# EAGLE design main (EAGLE 9.0.1)
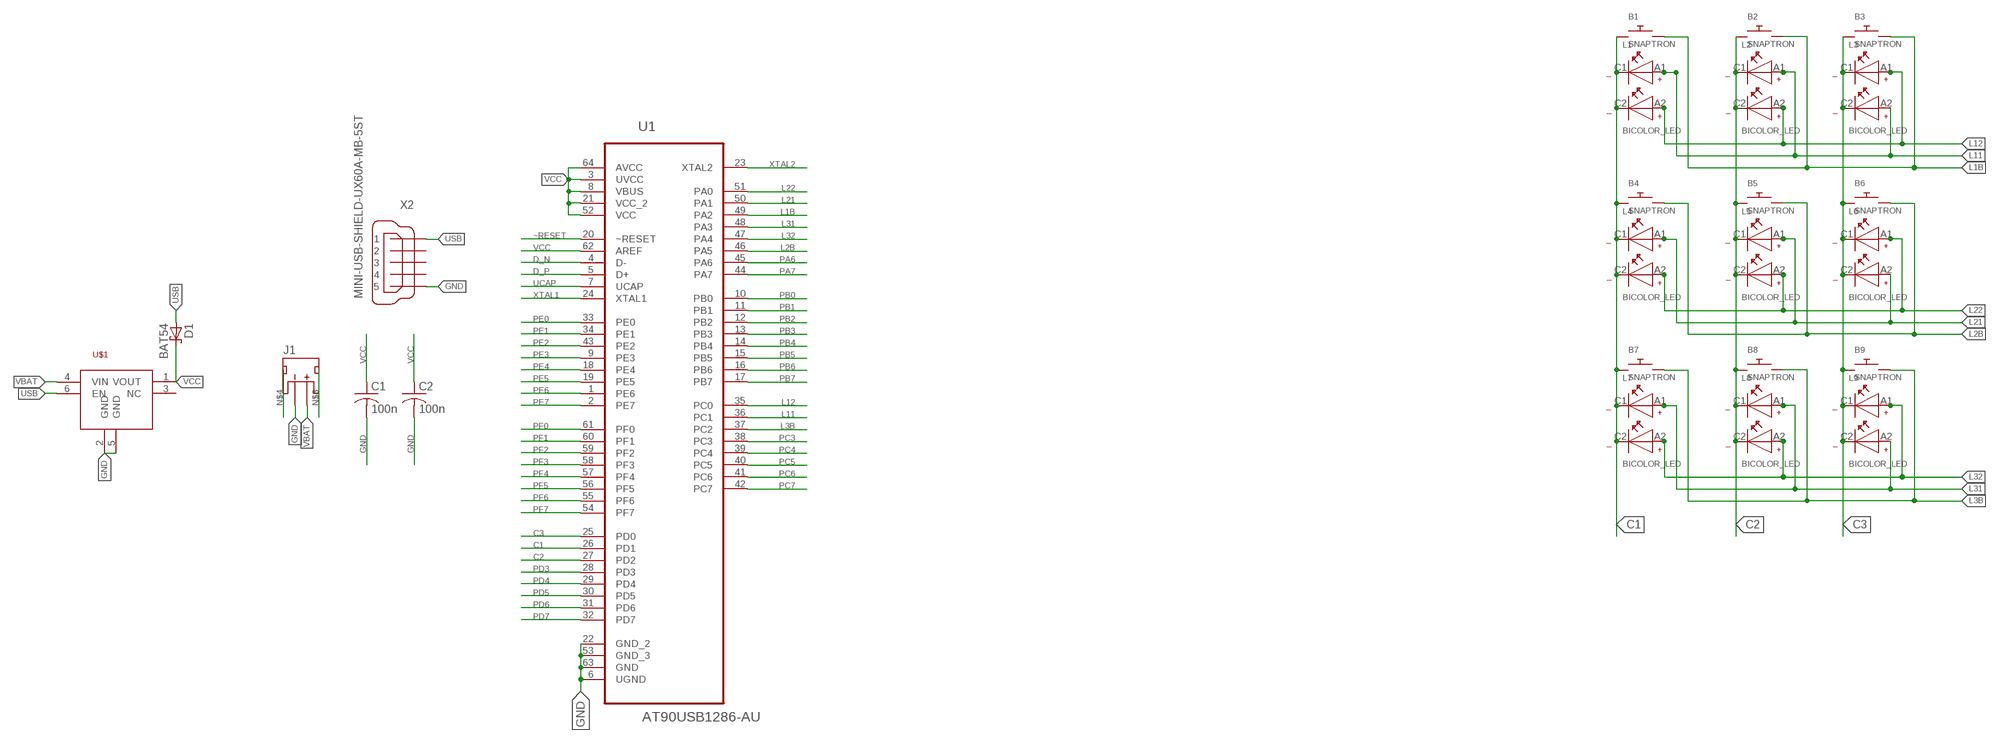
[diagram p0: schematic, sheet 1]

## Parts
B1  SNAPTRON  [SNAPTRON-8.5]
B2  SNAPTRON  [SNAPTRON-8.5]
B3  SNAPTRON  [SNAPTRON-8.5]
B4  SNAPTRON  [SNAPTRON-8.5]
B5  SNAPTRON  [SNAPTRON-8.5]
B6  SNAPTRON  [SNAPTRON-8.5]
B7  SNAPTRON  [SNAPTRON-8.5]
B8  SNAPTRON  [SNAPTRON-8.5]
B9  SNAPTRON  [SNAPTRON-8.5]
C1  100n  C-USC0603  [C0603]
C2  100n  C-USC0603  [C0603]
D1  BAT54  [SOT23]
J1  JST_2MM_MALE  [JST-2-SMD]
L1  BICOLOR_LED  [BICOLOR_LED]
L2  BICOLOR_LED  [BICOLOR_LED]
L3  BICOLOR_LED  [BICOLOR_LED]
L4  BICOLOR_LED  [BICOLOR_LED]
L5  BICOLOR_LED  [BICOLOR_LED]
L6  BICOLOR_LED  [BICOLOR_LED]
L7  BICOLOR_LED  [BICOLOR_LED]
L8  BICOLOR_LED  [BICOLOR_LED]
L9  BICOLOR_LED  [BICOLOR_LED]
U1  AT90USB1286-AU  [QFP80P1600X1600X120-64N]
U$1  MIC94090  [SC70-6L]
X2  MINI-USB-SHIELD-UX60A-MB-5ST  [UX60A-MB-5ST]

## Nets
C1: B1.P$1 B4.P$1 B7.P$1 L1.C1 L1.C2 L4.C1 L4.C2 L7.C1 L7.C2 U1.26(PD1)
C2: B2.P$1 B5.P$1 B8.P$1 L2.C1 L2.C2 L5.C1 L5.C2 L8.C1 L8.C2 U1.27(PD2)
C3: B3.P$1 B6.P$1 B9.P$1 L3.C1 L3.C2 L6.C1 L6.C2 L9.C1 L9.C2 U1.25(PD0)
D_N: U1.4(D-)
D_P: U1.5(D+)
GND: C1.2 C2.2 J1.1(-) U1.6(UGND) U1.22(GND_2) U1.53(GND_3) U1.63(GND) U$1.2(GND) U$1.5(GND) X2.5
L1B: B1.P$2 B2.P$2 B3.P$2 U1.49(PA2)
L2B: B4.P$2 B5.P$2 B6.P$2 U1.46(PA5)
L3B: B7.P$2 B8.P$2 B9.P$2 U1.37(PC2)
L11: L1.A1 L2.A1 L3.A2 U1.36(PC1)
L12: L1.A2 L2.A2 L3.A1 U1.35(PC0)
L21: L4.A1 L5.A1 L6.A2 U1.50(PA1)
L22: L4.A2 L5.A2 L6.A1 U1.51(PA0)
L31: L7.A1 L8.A1 L9.A2 U1.48(PA3)
L32: L7.A2 L8.A2 L9.A1 U1.47(PA4)
N$3: J1.NC2(PAD2)
N$4: J1.NC1(PAD1)
PA6: U1.45(PA6)
PA7: U1.44(PA7)
PB0: U1.10(PB0)
PB1: U1.11(PB1)
PB2: U1.12(PB2)
PB3: U1.13(PB3)
PB4: U1.14(PB4)
PB5: U1.15(PB5)
PB6: U1.16(PB6)
PB7: U1.17(PB7)
PC3: U1.38(PC3)
PC4: U1.39(PC4)
PC5: U1.40(PC5)
PC6: U1.41(PC6)
PC7: U1.42(PC7)
PD3: U1.28(PD3)
PD4: U1.29(PD4)
PD5: U1.30(PD5)
PD6: U1.31(PD6)
PD7: U1.32(PD7)
PE0: U1.33(PE0)
PE1: U1.34(PE1)
PE2: U1.43(PE2)
PE3: U1.9(PE3)
PE4: U1.18(PE4)
PE5: U1.19(PE5)
PE6: U1.1(PE6)
PE7: U1.2(PE7)
PF0: U1.61(PF0)
PF1: U1.60(PF1)
PF2: U1.59(PF2)
PF3: U1.58(PF3)
PF4: U1.57(PF4)
PF5: U1.56(PF5)
PF6: U1.55(PF6)
PF7: U1.54(PF7)
UCAP: U1.7(UCAP)
USB: D1.1(A) U$1.6(EN) X2.1
VBAT: J1.2(+) U$1.4(VIN)
VCC: C1.1 C2.1 D1.3(C) U1.3(UVCC) U1.8(VBUS) U1.21(VCC_2) U1.52(VCC) U1.62(AREF) U1.64(AVCC) U$1.1(VOUT)
XTAL1: U1.24(XTAL1)
XTAL2: U1.23(XTAL2)
~RESET: U1.20(~RESET)
Unconnected: U$1.3(NC) X2.2 X2.3 X2.4 X2.M1(S1) X2.M2(S2) X2.M3(S3) X2.M4(S4)

## Library data of the parts
B1-B9 = 7_segment_lib:SNAPTRON
C1 C2 = rcl:C-US: CAPACITOR, American symbol; SPICEPREFIX: C
D1 = diode:BAT54: Schottky Diodes Source: Fairchild .. BAT54.pdf
J1 = SparkFun-Connectors:JST_2MM_MALE: JST 2MM MALE RA CONNECTOR Two pin, compact surface mount connector. Commonly used as a battery input connection point. We really like the solid locking feeling and high current rating on these small connectors. We use these all the time as battery connectors. Mates to single-cell LiPo batteries. Here is the connector we sell at SparkFun: JST Right Angle Connector - White <https://www.sparkfun.com/products/8612> (PRT-08612) Datasheet <http://www.sparkfun.com/datasheets/Prototyping/Connectors/JST-Horizontal.pdf> It was used on these SparkFun products: SparkFun MOSFET Power Controller <https://www.sparkfun.com/products/11214> (PRT-11214) SparkFun Battery Babysitter - LiPo Battery Manager <https://www.sparkfun.com/products/13777> (PRT-13777) And many, many others that required a lipo battery connection.; PROD_ID: CONN-11443; SF_ID: PRT-08612
L1-L9 = 7_segment_lib:BICOLOR_LED
U1 = Atmel_By_element14_Batch_1-00:AT90USB1286-AU: MCU; DESCRIPTION: MCU; MPN: AT90USB1286-AU; OC_FARNELL: 1748495; OC_NEWARK: 26R5675; PACKAGE: QFP-64; SUPPLIER: Atmel
U$1 = 7_segment_lib:MIC94090
X2 = con-hirose:MINI-USB-SHIELD-: MINI USB Connector Source: http://www.hirose.co.jp/cataloge_hp/e24000019.pdf; OC_FARNELL: unknown; OC_NEWARK: unknown

## Board
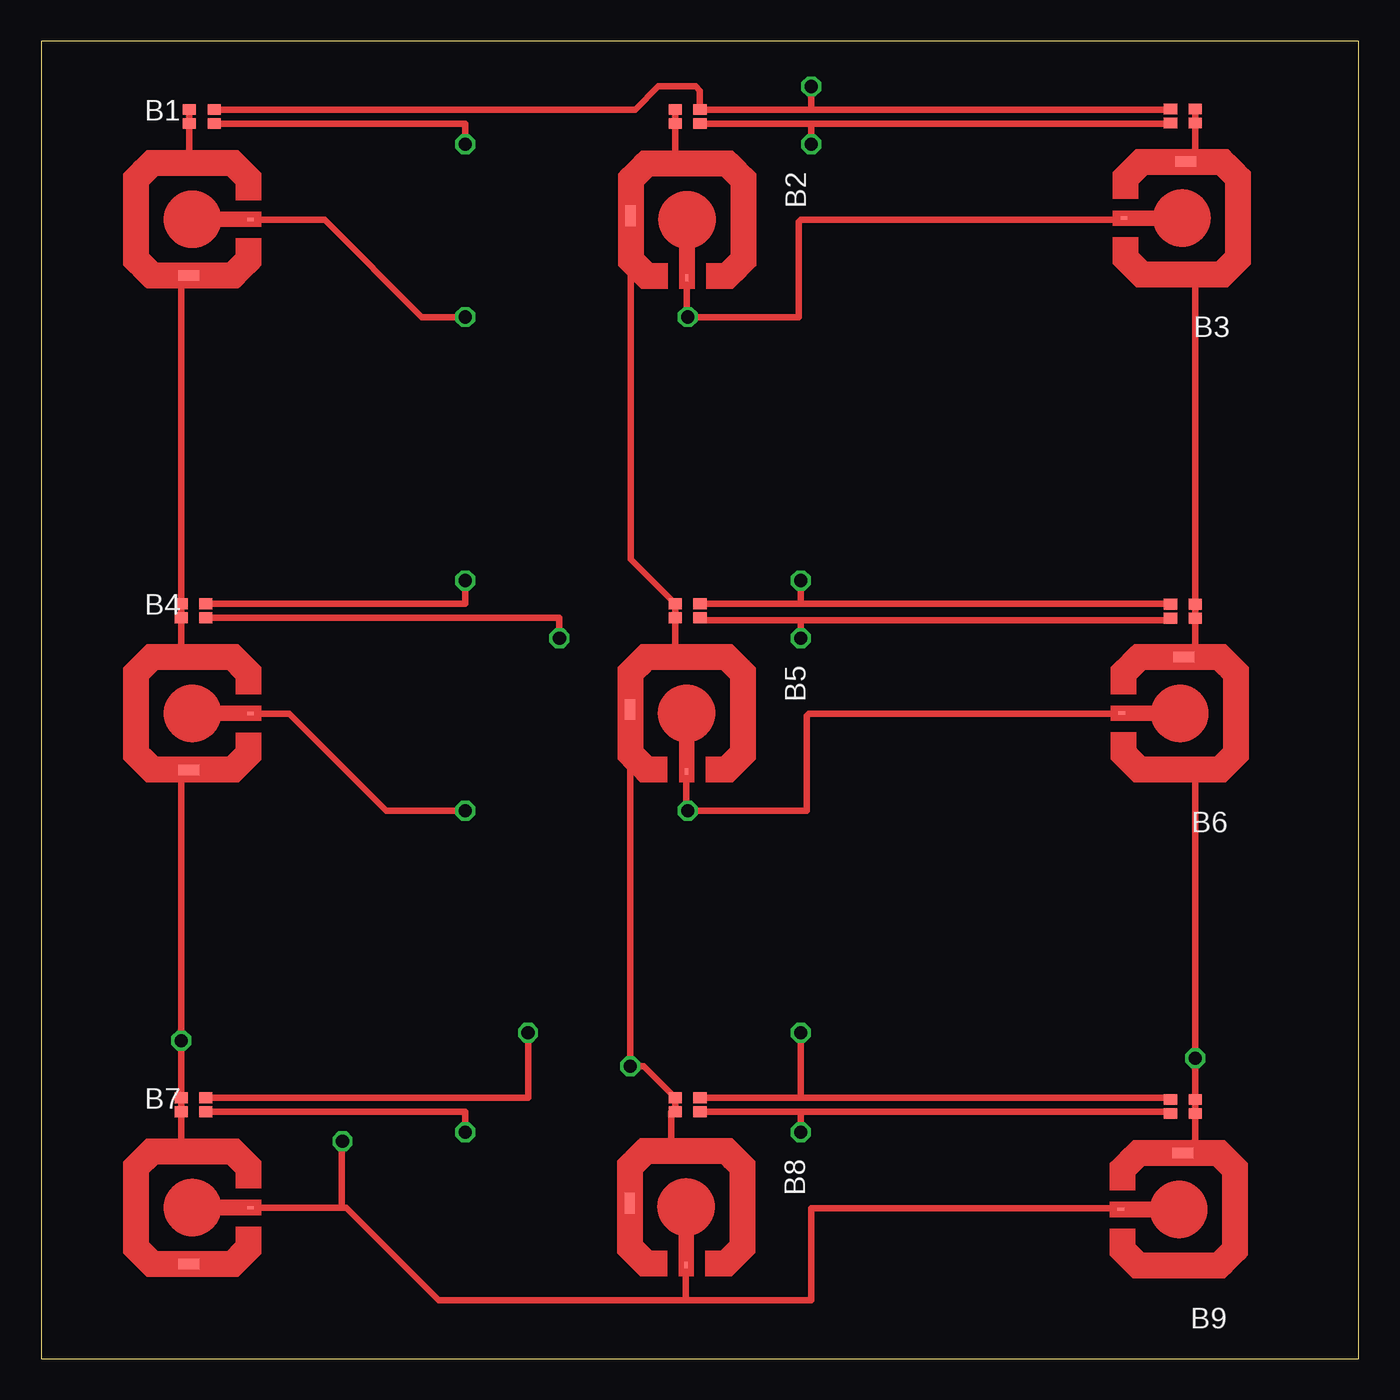
[diagram p1: board, top side]
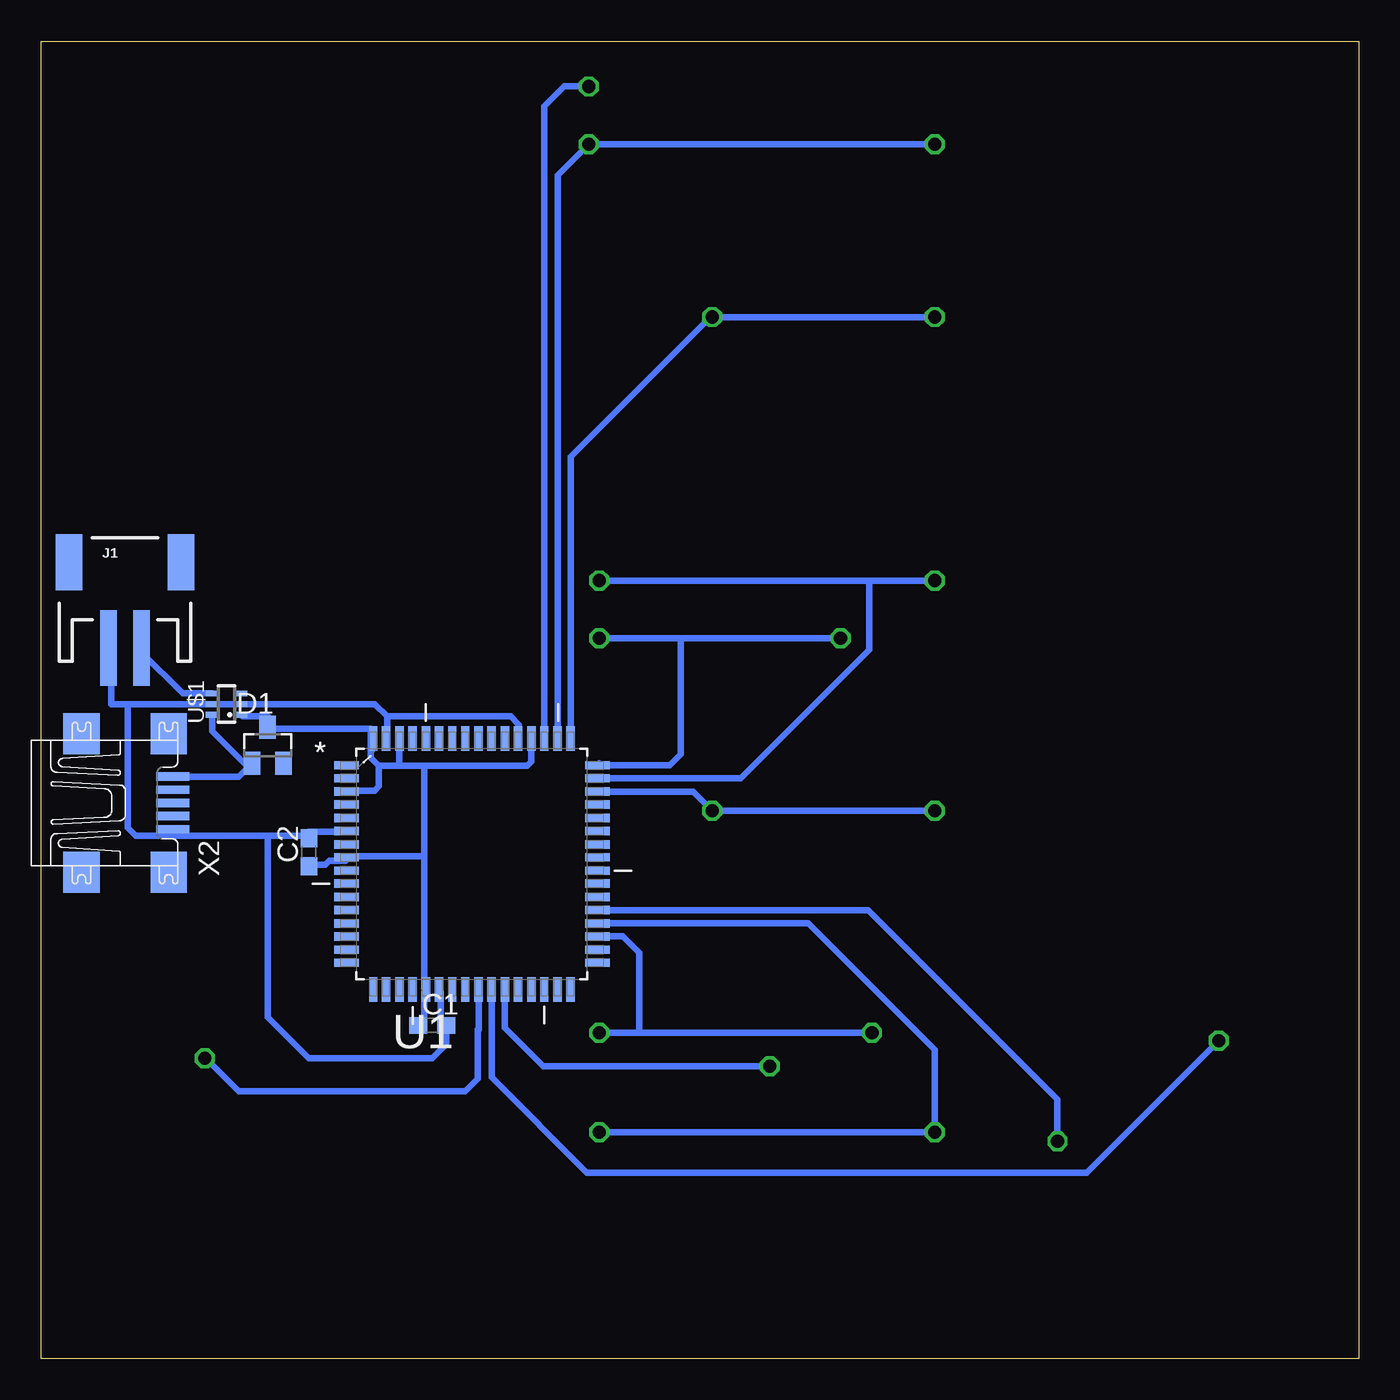
[diagram p2: board, bottom side, seen from below]

Size 80 x 80 mm. Coordinates in mm from the lower left corner, seen from the top.
Outline: 0,0 80,0 80,80 0,80 0,0
Copper layers (1*16): Top 0.035mm / dielectric 1.5mm / Bottom 0.035mm
Design rules "default *": minimum track width 16mil, minimum drill 0.35mm, track to track 6mil, track to pad 6mil, pad to pad 6mil, via to via 6mil, smd to smd 6mil, copper to edge 40mil, drill to drill 6mil, minimum pad ring 10mil, minimum via ring 8mil, stop-mask expansion 4mil, vias tented up to drill 0mil, thermal gap 10mil

### Footprints (pad centres in the part's own frame; a part is rotated, then mirrored left to right if it is on the bottom)
SNAPTRON-8.5 = smd 1.27 x 0.635: P$1 3.95,0.763 | smd 0.406 x 0.203: P$2 7.708,4.171
C0603 = smd 1.1 x 1: 1 -0.85,0; 2 0.85,0
SOT23 = smd 1 x 1.4: 1 -0.95,-1.1; 2 0.95,-1.1; 3 0,1.1
JST-2-SMD = smd 1 x 4.6: 1 -1,-3.7; 2 1,-3.7 | smd 1.6 x 3.4: NC1 -3.4,1.5; NC2 3.4,1.5
BICOLOR_LED = smd 0.8 x 0.65: A1 0,0; A2 0,-0.85; C1 1.5,0; C2 1.5,-0.85
QFP80P1600X1600X120-64N = smd 1.473 x 0.508: 1 -7.62,5.994; 2 -7.62,5.207; 3 -7.62,4.394; 4 -7.62,3.607; 5 -7.62,2.794; 6 -7.62,2.007; 7 -7.62,1.194; 8 -7.62,0.406; 9 -7.62,-0.406; 10 -7.62,-1.194; 11 -7.62,-2.007; 12 -7.62,-2.794; 13 -7.62,-3.607; 14 -7.62,-4.394; 15 -7.62,-5.207; 16 -7.62,-5.994; 33 7.62,-5.994; 34 7.62,-5.207; 35 7.62,-4.394; 36 7.62,-3.607; 37 7.62,-2.794; 38 7.62,-2.007; 39 7.62,-1.194; 40 7.62,-0.406; 41 7.62,0.406; 42 7.62,1.194; 43 7.62,2.007; 44 7.62,2.794; 45 7.62,3.607; 46 7.62,4.394; 47 7.62,5.207; 48 7.62,5.994 | smd 0.508 x 1.473: 17 -5.994,-7.62; 18 -5.207,-7.62; 19 -4.394,-7.62; 20 -3.607,-7.62; 21 -2.794,-7.62; 22 -2.007,-7.62; 23 -1.194,-7.62; 24 -0.406,-7.62; 25 0.406,-7.62; 26 1.194,-7.62; 27 2.007,-7.62; 28 2.794,-7.62; 29 3.607,-7.62; 30 4.394,-7.62; 31 5.207,-7.62; 32 5.994,-7.62; 49 5.994,7.62; 50 5.207,7.62; 51 4.394,7.62; 52 3.607,7.62; 53 2.794,7.62; 54 2.007,7.62; 55 1.194,7.62; 56 0.406,7.62; 57 -0.406,7.62; 58 -1.194,7.62; 59 -2.007,7.62; 60 -2.794,7.62; 61 -3.607,7.62; 62 -4.394,7.62; 63 -5.207,7.62; 64 -5.994,7.62
SC70-6L = smd 0.35 x 0.8: 1 -0.65,-0.85; 2 0,-0.85; 3 0.65,-0.85; 4 0.65,0.85; 5 0,0.85; 6 -0.65,0.85
UX60A-MB-5ST = smd 2 x 0.5: 1 2.25,1.6; 2 2.25,0.8; 3 2.25,0; 4 2.25,-0.8; 5 2.25,-1.6 | smd 2.2 x 2.5: M1 -3.3,-4.2; M2 -3.3,4.2; M3 2,4.2; M4 2,-4.2

### Placement (x,y rotation side)
B1  5,65 0 top
B2  35.03,73.34 270 top
B3  73.44,73.44 180 top
B4  5,35 0 top
B5  35,43.37 270 top
B6  73.32,43.37 180 top
B7  5,5 0 top
B8  34.97,13.4 270 top
B9  73.25,13.25 180 top
C1  56.25,20.25 0 bottom
C2  63.75,30.75 90 bottom
D1  66.25,37.25 0 bottom
J1  74.91,46.86 0 bottom
L1  10,15 180 top
L2  40,15 180 top
L3  68.57,15.75 0 top
L4  10.5,75 180 top
L5  40,75 180 top
L6  68.57,75.89 0 top
L7  10,45 180 top
L8  40,45 180 top
L9  68.57,45.82 0 top
U1  53.85,30.04 0 bottom
U$1  68.75,39.75 90 bottom
X2  74.25,33.75 0 bottom

### Tracks (layer width: path | path; a pad name or v marks a point on that pad's centre or on a via)
C1  (via drill 0.8)
  Top 0.406: B7.P$1 7.46,5.76 5.72,7.5 5.72,11.44 6.74,12.45 8.52,12.45 8.52,14.98 L1.C1 L1.C2 v8.5,19.32 | v8.5,19.32 8.5,30.25 v8.5,19.32 | v8.5,19.32 8.5,35.31 | 8.5,35.31 8.5,35.71 8.39,35.82 | L4.C2 L4.C1 9,72.75 8.64,72.4 6.61,72.4 5.85,71.63 5.85,66.94 7.02,65.76 B1.P$1 8.5,65.31 L7.C2 L7.C1 8.52,44.98 8.52,42.55 6.74,42.55 5.85,41.66 5.85,37.09 7.18,35.76 B4.P$1 8.5,35.31 | v8.5,19.32 8.5,35.31
  Bottom 0.406: v8.5,19.32 16.51,11.31 46.87,11.31 52.65,17.09 U1.26
C2  (via drill 0.8)
  Top 0.406: B8.P$1 35.73,11.73 36.75,12.75 38.25,12.75 38.25,15 L2.C1 L2.C2 36.59,17.77 v35.76,17.77 35.76,39.25 | 35.76,39.25 B5.P$1 | 35.76,39.25 35.76,41.76 36.75,42.75 38.25,42.75 38.5,43 L8.C1 L8.C2 35.79,48.56 35.79,69.25 | 35.79,69.25 B2.P$1 | L5.C2 L5.C1 38.5,73 38.25,72.75 37.25,72.75 35.75,71.25 35.75,69.29 35.79,69.25
  Bottom 0.406: v35.76,17.77 49.52,17.77 51.84,20.09 U1.27
C3  (via drill 0.8)
  Top 0.406: B9.P$1 70.07,13.26 L3.C2 L3.C1 v70.07,18.25 70.07,35.53 70.36,35.82 71.51,35.82 72.52,36.84 72.52,41.03 71.38,42.17 71.38,42.68 69.44,42.68 B6.P$1 70.07,43.31 L9.C2 L9.C1 70.07,65.5 70.49,65.92 71.38,65.92 72.65,67.19 72.65,71.51 71.38,72.78 69.59,72.78 B3.P$1 70.07,73.26 L6.C2 L6.C1
  Bottom 0.406: 53.44,19.98 53.44,20 | 53.44,20 U1.25 | v70.07,18.25 70,18.25 68,16.25 54.25,16.25 53.5,17 53.5,20 53.44,20
GND
  Bottom 0.406: C1.2 55.5,20.25 55.75,20.5 55.75,22.25 U1.22 | 71.75,31.75 72,31.75 72,32 X2.5 | 71.75,31.75 66.25,31.75 | 66.25,31.75 64.75,31.75 63.75,31.75 | 63.75,31.75 C2.2 63.75,31.75 | 63.75,31.75 63.75,32 61.5,32 U1.6 | 55.75,20.25 C1.2 | 59,39 51.5,39 51,38.5 51,37.75 U1.53 | 59,39 59,37.75 U1.63 | 74.75,39.75 75.75,39.75 75.75,43 J1.1 | 74.75,39.75 69.75,39.75 U$1.5 69.5,39.75 68.75,39.75 68,39.75 U$1.2 59.75,39.75 59,39 | C1.2 55.4,19.1 56.25,18.25 63.75,18.25 66.25,20.75 66.25,31.75 | 71.75,31.75 74.25,31.75 74.75,32.25 74.75,39.75
L1B  (via drill 0.8)
  Top 0.406: B1.P$2 17.2,69.17 23.12,63.25 v25.75,63.25 | B3.P$2 65.63,69.17 63.33,69.17 46.11,69.17 45.98,69.04 45.98,63.25 v39.25,63.25 39.2,63.3 B2.P$2
  Bottom 0.406: v25.75,63.25 v39.25,63.25 39.38,63.25 47.85,54.78 U1.49
L2B  (via drill 0.8)
  Top 0.406: B4.P$2 15.07,39.17 20.96,33.28 v25.75,33.28 | B6.P$2 65.58,39.17 46.62,39.17 46.49,39.04 46.49,33.28 v39.25,33.28 39.17,33.36 B5.P$2
  Bottom 0.406: v25.75,33.28 v39.25,33.28 40.41,34.44 U1.46
L3B  (via drill 0.8)
  Top 0.406: B7.P$2 18.25,9.17 | 18.25,9.17 18.53,9.17 24.14,3.56 39.12,3.56 | 39.12,3.56 46.74,3.56 46.74,9.15 64.52,9.15 | 64.27,9.15 64.52,9.15 | 64.52,9.15 64.65,9.15 65.48,9.15 B9.P$2 | B8.P$2 39.14,3.58 39.12,3.56 | v18.3,13.21 18.25,13.17 18.25,9.17
  Bottom 0.406: U1.37 29.79,27.25 18.3,15.75 v18.3,13.21
L11  (via drill 0.8)
  Top 0.406: L1.A1 22.25,15 25.75,15 v25.75,13.75 | L3.A2 68.57,14.99 46.12,14.99 | 46.12,14.99 40.25,14.99 40.25,15 L2.A1 | v46.12,13.75 46.12,14.99
  Bottom 0.406: v46.12,13.75 v25.75,13.75 25.75,18.77 33.42,26.44 U1.36
L12  (via drill 0.8)
  Top 0.406: L1.A2 29.56,15.85 v29.56,19.79 | L3.A1 68.57,15.85 46.12,15.85 | L2.A2 46.12,15.85 | v46.12,19.79 46.12,15.85
  Bottom 0.406: v29.56,19.79 29.73,19.79 38.62,19.79 43.7,19.79 | 43.7,19.79 v46.12,19.79 | U1.35 44.7,25.65 43.7,24.64 43.7,19.79
L21  (via drill 0.8)
  Top 0.406: L4.A1 25.75,75 v25.75,73.75 | L6.A2 68.53,75 46.75,75 | L5.A1 46.75,75 | v46.75,73.75 46.75,75
  Bottom 0.406: v25.75,73.75 v46.75,73.75 48.64,71.86 U1.50
L22  (via drill 0.8)
  Top 0.406: L4.A2 36.08,75.85 37.48,77.25 39.75,77.25 40,77 L5.A2 46.75,75.85 | L6.A1 68.53,75.85 46.75,75.85 | 46.75,75.85 v46.75,77.25
  Bottom 0.406: U1.51 49.45,76.04 48.24,77.25 v46.75,77.25
L31  (via drill 0.8)
  Top 0.406: L7.A1 31.46,45 v31.46,43.75 | L8.A1 40,44.84 46.12,44.84 | L9.A2 68.57,44.84 46.12,44.84 | v46.12,43.75 46.12,44.84
  Bottom 0.406: v31.46,43.75 41.16,43.75 | 41.16,43.75 v46.12,43.75 | 46.12,36.15 U1.48 41.83,36.04 41.16,36.71 41.16,43.75
L32  (via drill 0.8)
  Top 0.406: L7.A2 25.75,45.85 v25.75,47.25 | L9.A1 68.57,45.85 46.12,45.85 | L8.A2 46.12,45.85 | 46.12,45.85 v46.12,47.25
  Bottom 0.406: v46.12,47.25 29.73,47.25 | 29.73,47.25 v25.75,47.25 | 29.73,47.25 29.73,43.06 37.53,35.25 U1.47
USB
  Bottom 0.406: X2.1 68,35.35 67.42,35.92 | 67.42,35.92 D1.1 | U$1.6 69.6,38.1 67.42,35.92
VBAT
  Bottom 0.406: U$1.4 71.4,40.4 73.91,42.91 J1.2
VCC
  Bottom 0.406: C2.1 63.75,30 62.75,30 62.5,30.25 61.5,30.25 U1.8 61.25,30.5 56.75,30.5 | C1.1 57,20.25 56.75,20.5 56.75,22.25 U1.21 56.75,22.5 56.75,30.5 | U$1.1 67.75,39 66.25,39 66.25,38.5 D1.3 66.25,38.25 60,38.25 60,37.75 | 56.75,36 50.5,36 50.25,36.25 50.25,37.5 U1.52 | 58.25,37.5 U1.62 58.25,36 | 60,37.75 U1.64 | 56.75,30.5 56.75,36 | U1.3 61.41,34.5 59.75,34.5 59.5,34.75 59.5,36 | 56.75,36 58.25,36 | 58.25,36 59.5,36 | 60,37.75 60,36.5 59.5,36